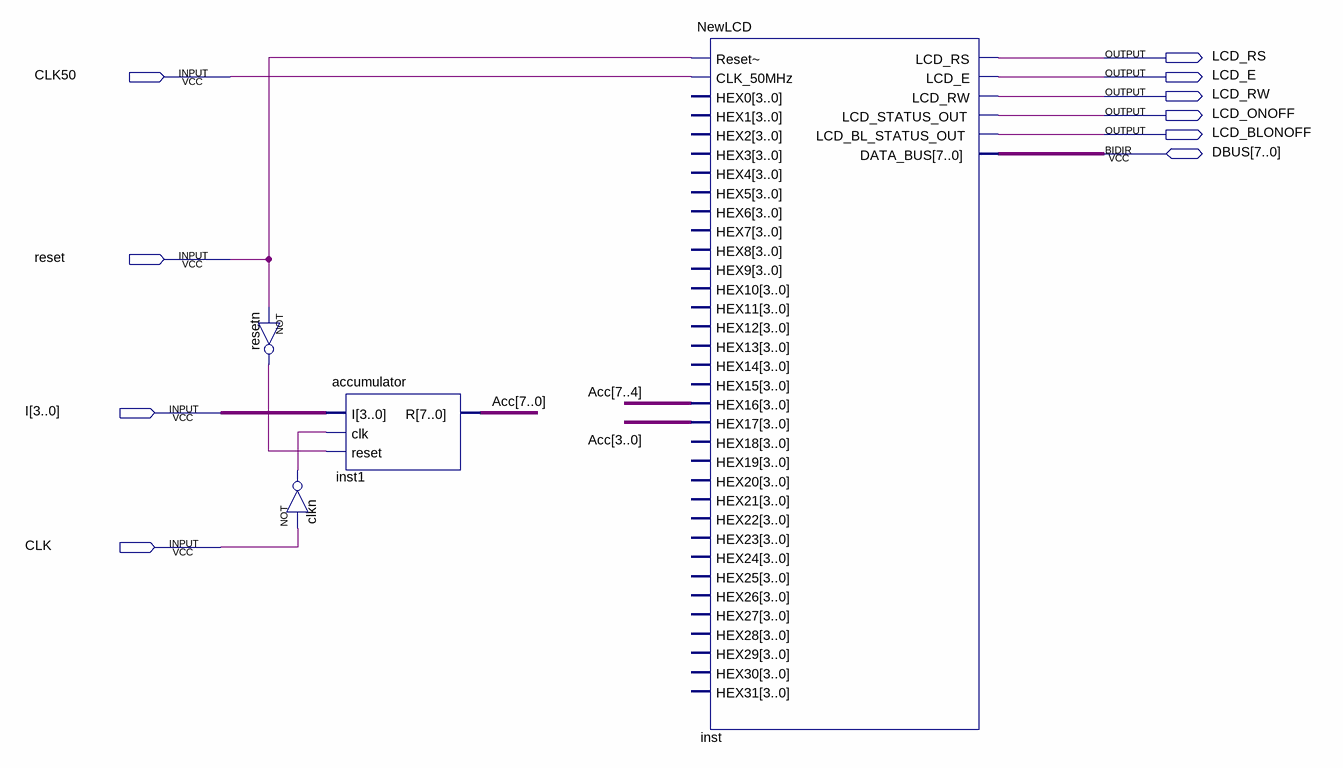
[diagram p0: schematic sheet]
// Quartus schematic Acc_LCD.bdf as structural Verilog: 4 symbols, 10 pins
module Acc_LCD (
  input  CLK50,
  input  reset,
  input  [3:0] I,
  input  CLK,
  inout  [7:0] DBUS,
  output LCD_RS,
  output LCD_E,
  output LCD_RW,
  output LCD_ONOFF,
  output LCD_BLONOFF
);

  wire clkn_out, resetn_out;
  wire [7:0] Acc;

  not resetn (resetn_out, reset);
  not clkn (clkn_out, CLK);
  accumulator inst1 (.I(I), .clk(clkn_out), .reset(resetn_out), .R(Acc));
  NewLCD inst (
    .\Reset~ (reset), .CLK_50MHz(CLK50), .HEX16(Acc[7:4]), .HEX17(Acc[3:0]), .LCD_RS(LCD_RS), .LCD_E(LCD_E),
    .LCD_RW(LCD_RW), .LCD_STATUS_OUT(LCD_ONOFF), .LCD_BL_STATUS_OUT(LCD_BLONOFF), .DATA_BUS(DBUS));  // open: HEX0, HEX1, HEX2, HEX3, HEX4, HEX5, HEX6, HEX7, HEX8, HEX9, HEX10, HEX11, HEX12, HEX13, HEX14, HEX15, HEX18, HEX19, HEX20, HEX21, HEX22, HEX23, HEX24, HEX25, HEX26, HEX27, HEX28, HEX29, HEX30, HEX31
endmodule
